# EAGLE schematic smarty01 (EAGLE 6.5.0)
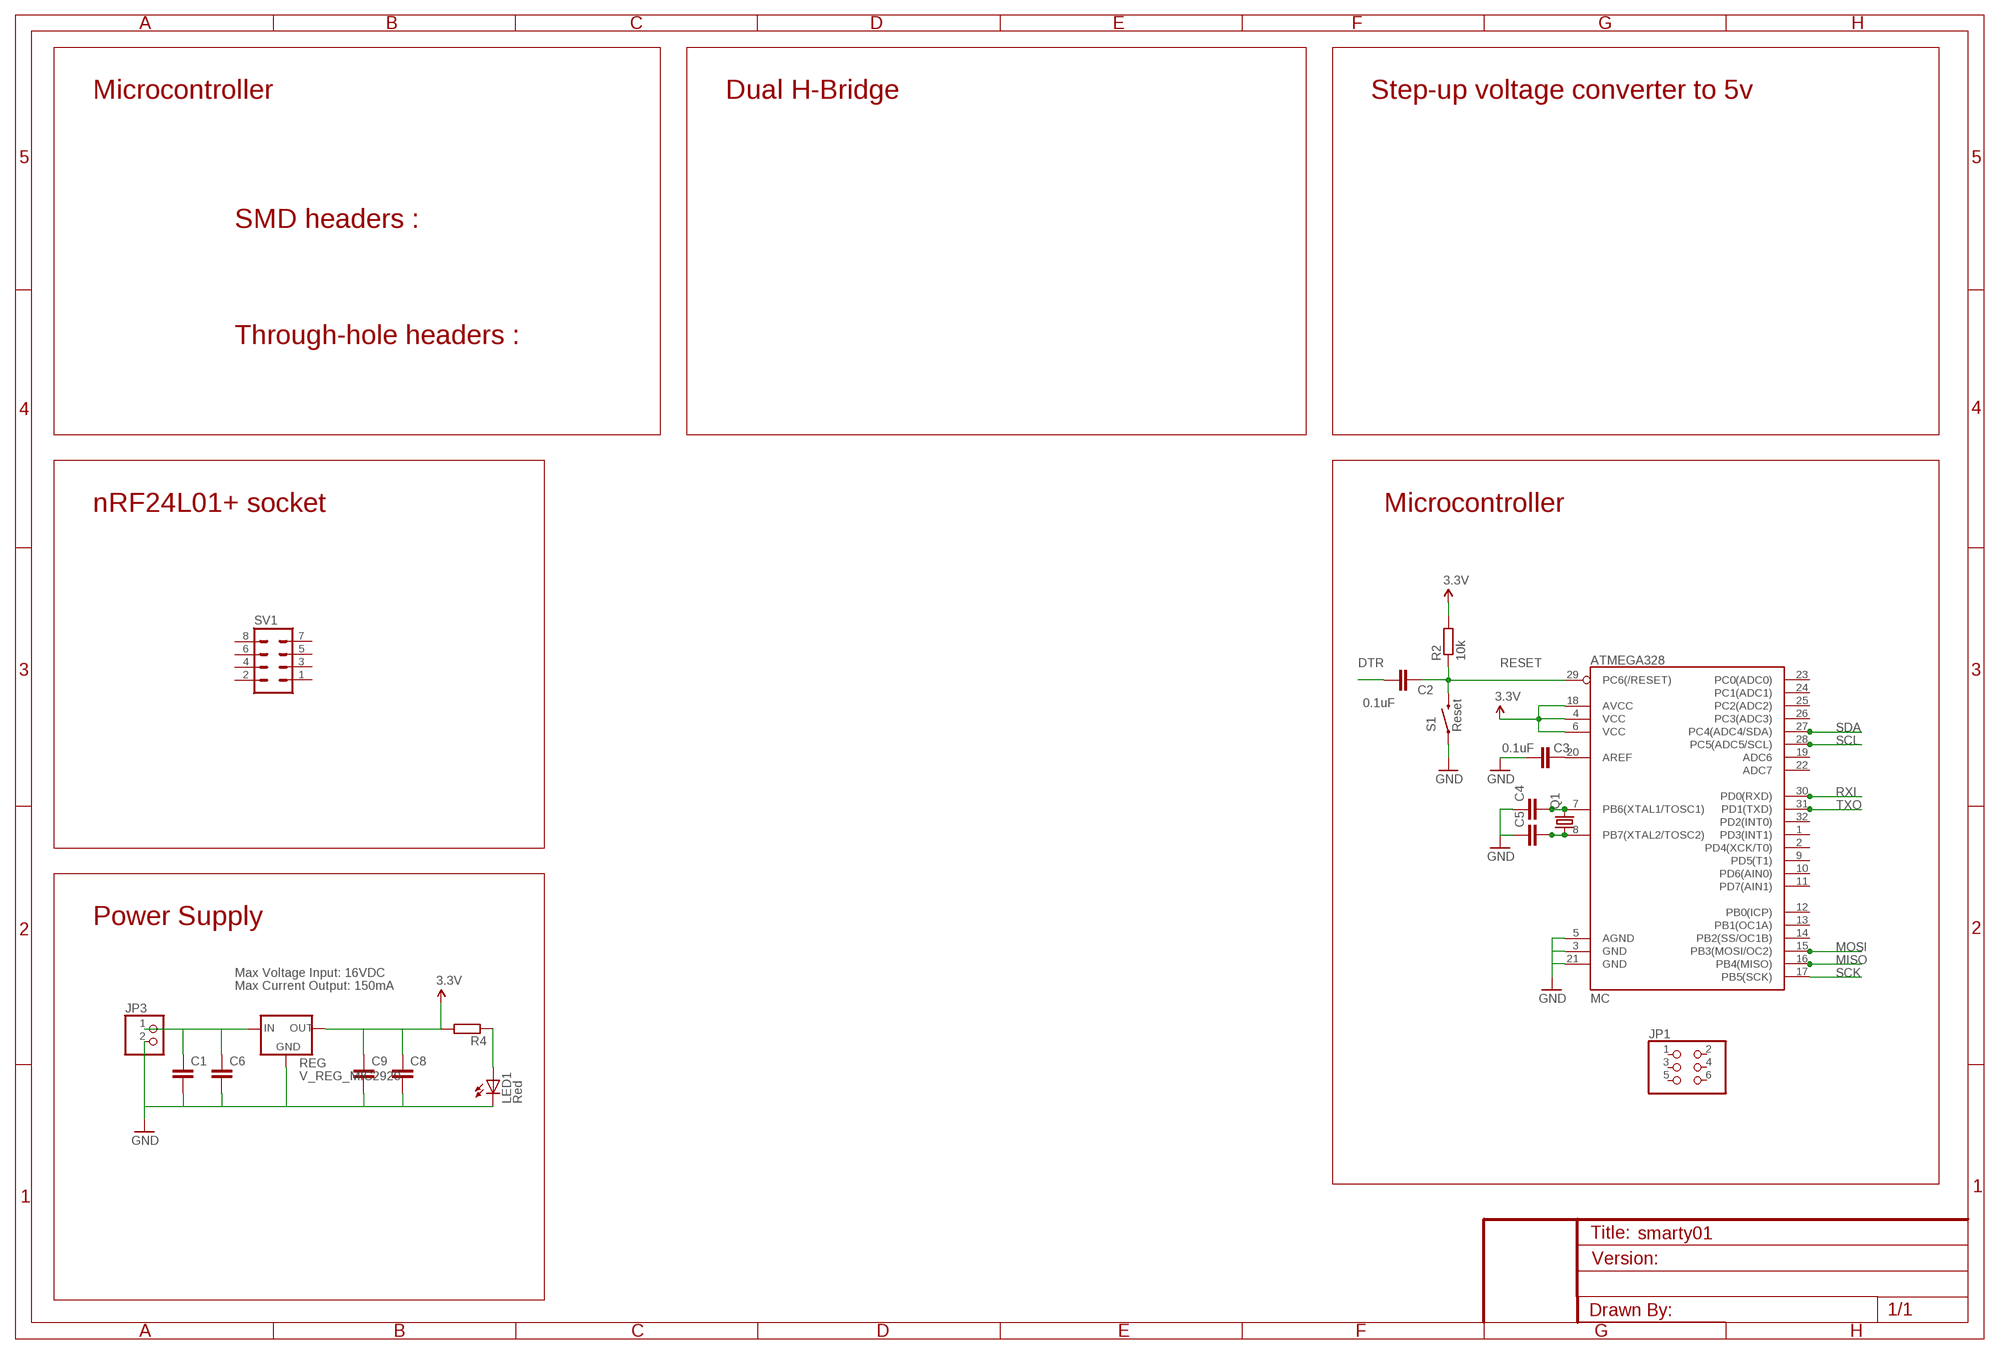
[diagram p0: schematic, sheet 1]

## Parts
C1  C-EUC0805  [C0805]
C2  0.1uF  C-EUC0805  [C0805]
C3  0.1uF  C-EUC0805  [C0805]
C4  C-EUC0805  [C0805]
C5  C-EUC0805  [C0805]
C6  C-EUC0805  [C0805]
C8  C-EUC0805  [C0805]
C9  C-EUC0805  [C0805]
JP1  PINHD-2X03_2.54-SMD  [2X03SMD]
JP3  PINHD-1X2  [1X02]
LED1  Red  LED0603  [LED-0603]
MC  ATMEGA328  ATMEGA168  [TQFP32-08]
Q1  CRYSTALHC49UP  [HC49UP]
R2  10k  R-EU_R0805  [R0805]
R4  R-EU_R0805  [R0805]
REG  V_REG_MIC2920  [SOT223]
S1  Reset  SWITCH-MOMENTARY-2SMD  [TACTILE_SWITCH_SMD]
SV1  MA04-2  [MA04-2]

## Nets
3.3V: C8.1 C9.1 MC.4(VCC) MC.6(VCC) MC.18(AVCC) R2.2 R4.2 REG.3(OUT)
DTR: C2.1
GND: C1.2 C3.2 C4.1 C5.1 C6.2 C8.2 C9.2 JP3.2 LED1.C MC.3(GND) MC.5(AGND) MC.21(GND) REG.2(GND) S1.1
MISO: MC.16(PB4(MISO))
MOSI: MC.15(PB3(MOSI/OC2))
N$1: C3.1 MC.20(AREF)
N$2: C4.2 MC.7(PB6(XTAL1/TOSC1)) Q1.2
N$4: C5.2 MC.8(PB7(XTAL2/TOSC2)) Q1.1
N$5: LED1.A R4.1
N$6: C1.1 C6.1 JP3.1 REG.1(IN)
RESET: C2.2 MC.29(PC6(/RESET)) R2.1 S1.3
RXI: MC.30(PD0(RXD))
SCK: MC.17(PB5(SCK))
SCL: MC.28(PC5(ADC5/SCL))
SDA: MC.27(PC4(ADC4/SDA))
TXO: MC.31(PD1(TXD))
Unconnected: JP1.1 JP1.2 JP1.3 JP1.4 JP1.5 JP1.6 MC.1(PD3(INT1)) MC.2(PD4(XCK/T0)) MC.9(PD5(T1)) MC.10(PD6(AIN0)) MC.11(PD7(AIN1)) MC.12(PB0(ICP)) MC.13(PB1(OC1A)) MC.14(PB2(SS/OC1B)) MC.19(ADC6) MC.22(ADC7) MC.23(PC0(ADC0)) MC.24(PC1(ADC1)) MC.25(PC2(ADC2)) MC.26(PC3(ADC3)) MC.32(PD2(INT0)) SV1.1 SV1.2 SV1.3 SV1.4 SV1.5 SV1.6 SV1.7 SV1.8

## Notes on the sheet
- Microcontroller | Dual H-Bridge | Step-up voltage converter to 5v
- SMD headers :
- Through-hole headers :
- nRF24L01+ socket | Microcontroller
- Power Supply
- Max Voltage Input: 16VDC
- Max Current Output: 150mA

## Library data of the parts
C1-C6 C8 C9 = rcl:C-EU: CAPACITOR, European symbol
JP1 = pinhead-2:PINHD-2X03: PIN HEADER
JP3 = pinhead:PINHD-1X2: PIN HEADER
LED1 = SparkFun:LED: LEDs Standard schematic elements and footprints for 5mm, 3mm, 1206, and 0603 sized LEDs. 5mm - Spark Fun Electronics SKU : COM-00529 (and others)
MC = SparkFun:ATMEGA168
Q1 = crystal:CRYSTAL: CRYSTAL; OC_FARNELL: unknown; OC_NEWARK: unknown
R2 R4 = rcl:R-EU_: RESISTOR, European symbol
REG = SparkFun:V_REG_MIC2920: MIC2920A (http://www.micrel.com/_PDF/mic2920.pdf) - 400mA output LDO Regulator
S1 = SparkFun:SWITCH-MOMENTARY-2
SV1 = con-lstb:MA04-2: PIN HEADER; OC_FARNELL: unknown; OC_NEWARK: unknown

## Net classes
1 vcc: width 0.254 mm